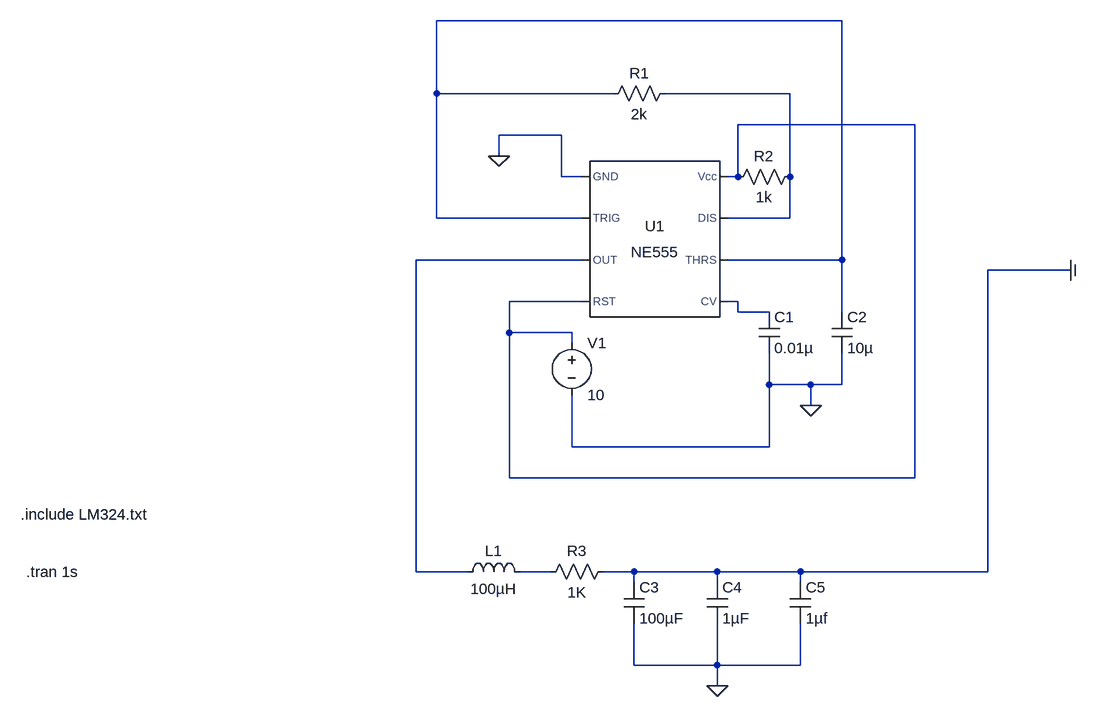
[diagram p0: schematic signal_generator.asc]
signal_generator.asc, the LTspice schematic file:
Version 4
SHEET 1 928 884
WIRE 464 -160 -160 -160
WIRE -160 -48 -160 -160
WIRE 112 -48 -160 -48
WIRE 384 -48 192 -48
WIRE 576 0 304 0
WIRE 32 16 -64 16
WIRE -64 48 -64 16
WIRE 32 80 32 16
WIRE 64 80 32 80
WIRE 304 80 304 0
WIRE 304 80 288 80
WIRE 384 80 384 -48
WIRE -160 144 -160 -48
WIRE 64 144 -160 144
WIRE 384 144 384 80
WIRE 384 144 288 144
WIRE 64 208 -192 208
WIRE 464 208 464 -160
WIRE 464 208 288 208
WIRE 816 224 688 224
WIRE 64 272 -48 272
WIRE 304 272 288 272
WIRE 304 288 304 272
WIRE 352 288 304 288
WIRE 464 288 464 208
WIRE -48 320 -48 272
WIRE 48 320 -48 320
WIRE 48 336 48 320
WIRE 352 400 352 352
WIRE 416 400 352 400
WIRE 464 400 464 352
WIRE 464 400 416 400
WIRE 416 432 416 400
WIRE 48 496 48 416
WIRE 352 496 352 400
WIRE 352 496 48 496
WIRE -48 544 -48 320
WIRE 576 544 576 0
WIRE 576 544 -48 544
WIRE -192 688 -192 208
WIRE -112 688 -192 688
WIRE 16 688 -32 688
WIRE 144 688 96 688
WIRE 272 688 144 688
WIRE 400 688 272 688
WIRE 688 688 688 224
WIRE 688 688 400 688
WIRE 144 704 144 688
WIRE 272 704 272 688
WIRE 400 704 400 688
WIRE 144 832 144 768
WIRE 272 832 272 768
WIRE 272 832 144 832
WIRE 400 832 400 768
WIRE 400 832 272 832
WIRE 272 864 272 832
FLAG 416 432 0
FLAG -64 48 0
FLAG 816 224 COM
IOPIN 816 224 Out
FLAG 272 864 0
SYMBOL Misc\\NE555 176 176 R0
SYMATTR InstName U1
SYMBOL cap 336 288 R0
SYMATTR InstName C1
SYMATTR Value 0.01µ
SYMBOL cap 448 288 R0
SYMATTR InstName C2
SYMATTR Value 10µ
SYMBOL res 208 -64 R90
WINDOW 0 0 56 VBottom 2
WINDOW 3 32 56 VTop 2
SYMATTR InstName R1
SYMATTR Value 2k
SYMBOL res 400 64 R90
WINDOW 0 0 56 VBottom 2
WINDOW 3 32 56 VTop 2
SYMATTR InstName R2
SYMATTR Value 1k
SYMBOL voltage 48 320 R0
WINDOW 123 0 0 Left 0
WINDOW 39 0 0 Left 0
SYMATTR InstName V1
SYMATTR Value 10
SYMBOL ind -128 704 R270
WINDOW 0 32 56 VTop 2
WINDOW 3 5 56 VBottom 2
SYMATTR InstName L1
SYMATTR Value 100µH
SYMBOL cap 128 704 R0
SYMATTR InstName C3
SYMATTR Value 100µF
SYMBOL cap 256 704 R0
SYMATTR InstName C4
SYMATTR Value 1µF
SYMBOL cap 384 704 R0
SYMATTR InstName C5
SYMATTR Value 1µf
SYMBOL res 112 672 R90
WINDOW 0 0 56 VBottom 2
WINDOW 3 32 56 VTop 2
SYMATTR InstName R3
SYMATTR Value 1K
TEXT -792 688 Left 2 !.tran 1s
TEXT -800 600 Left 2 !.include LM324.txt

The netlist it stands for:
* signal_generator.asc
XU1 0 N001 N004 N003 N005 N001 N002 N003 NE555  ; pins GND TRIG OUT RST CV THRS DIS Vcc
C1 N005 0 0.01µ
C2 N001 0 10µ
R1 N002 N001 2k
R2 N002 N003 1k
V1 N003 0 10
L1 N004 N006 100µH
C3 COM 0 100µF
C4 COM 0 1µF
C5 COM 0 1µf
R3 COM N006 1K
.tran 1s
.include LM324.txt
.lib NE555.sub
.backanno
.end